# EAGLE design v1.0 (EAGLE 9.2.2)
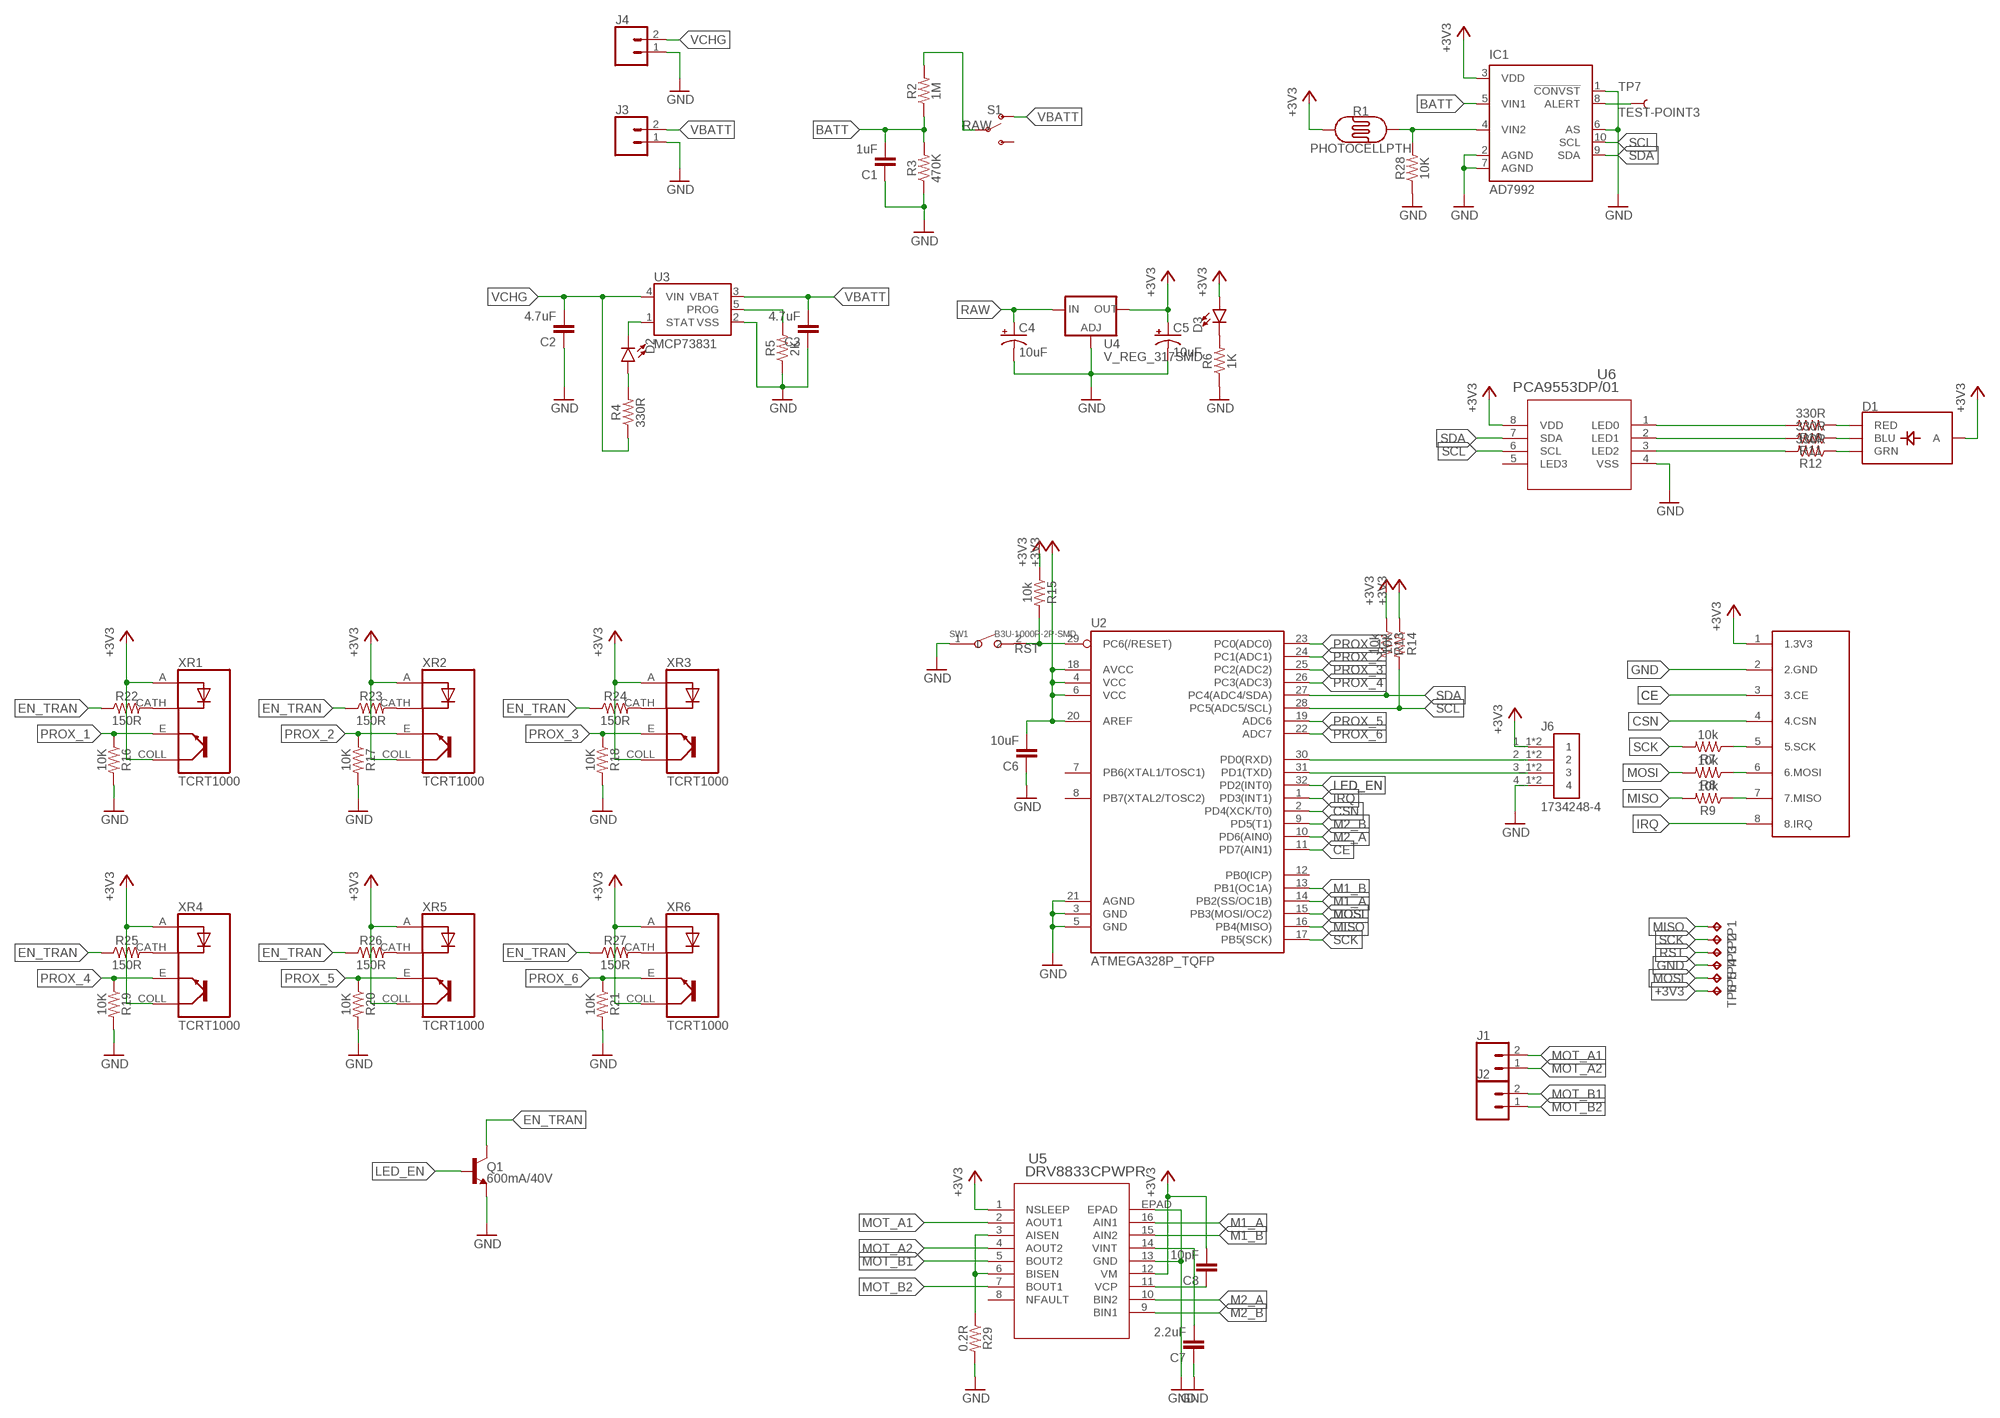
[diagram p0: schematic, sheet 1]

## Parts
C1  1uF  C-EUC0603  [C0603]
C2  4.7uF  C-EUC0603  [C0603]
C3  4.7uF  C-EUC0603  [C0603]
C4  10uF  10UF-POLAR-EIA3216-16V-10%(TANT)  [EIA3216]
C5  10uF  10UF-POLAR-EIA3216-16V-10%(TANT)  [EIA3216]
C6  10uF  C-EUC0603  [C0603]
C7  2.2uF  C-EUC0603  [C0603]
C8  10pF  C-EUC0603  [C0603]
D1  LED-RGB-CASMD  [LED-TRICOLOR-SMD]
D2  LED0603  [LED-0603]
D3  LED0603  [LED-0603]
IC1  AD7992  [MSOP10]
J1  CONN_02  [1X02]
J2  CONN_02  [1X02]
J3  CONN_02  [1X02]
J4  CONN_02  [1X02]
J6  1734248-4  [TE_1734248-4]
Q1  600mA/40V  TRANS_NPN-MMBT2222AL  [SOT23-3]
R1  PHOTOCELLPTH  [PHOTOCELL]
R2  1M  RESISTOR0402  [0402]
R3  470K  RESISTOR0402  [0402]
R4  330R  RESISTOR0402  [0402]
R5  2K  RESISTOR0402  [0402]
R6  1K  RESISTOR0402  [0402]
R7  10k  RESISTOR0402  [0402]
R8  10k  RESISTOR0402  [0402]
R9  10k  RESISTOR0402  [0402]
R10  330R  RESISTOR0402  [0402]
R11  330R  RESISTOR0402  [0402]
R12  330R  RESISTOR0402  [0402]
R13  10k  RESISTOR0402  [0402]
R14  10k  RESISTOR0402  [0402]
R15  10k  RESISTOR0402  [0402]
R16  10K  RESISTOR0402  [0402]
R17  10K  RESISTOR0402  [0402]
R18  10K  RESISTOR0402  [0402]
R19  10K  RESISTOR0402  [0402]
R20  10K  RESISTOR0402  [0402]
R21  10K  RESISTOR0402  [0402]
R22  150R  RESISTOR0402  [0402]
R23  150R  RESISTOR0402  [0402]
R24  150R  RESISTOR0402  [0402]
R25  150R  RESISTOR0402  [0402]
R26  150R  RESISTOR0402  [0402]
R27  150R  RESISTOR0402  [0402]
R28  10K  RESISTOR0402  [0402]
R29  0.2R  RESISTOR0402  [0402]
S1  SWITCH-SPDT-SMD-RIGHT-ANGLE  [SWITCH_SPST_SMD_A]
SW1  B3U-1000P-2P-SMD  SMD-BUTTON(2P-3.0X2.5X1.2+0.4MM)-B3U-1000P-2P-SMD  [SW2-2.6-3.0X2.5X1.2+0.4MM]
TP1  TPB1,27  [B1,27]
TP2  TPB1,27  [B1,27]
TP3  TPB1,27  [B1,27]
TP4  TPB1,27  [B1,27]
TP5  TPB1,27  [B1,27]
TP6  TPB1,27  [B1,27]
TP7  TEST-POINT3  [PAD.03X.03]
U2  ATMEGA328P_TQFP  [TQFP32-08]
U3  MCP73831  [SOT23-5]
U4  V_REG_317SMD  [SOT223]
U5  DRV8833CPWPR  [PWP16_2P31X2P46]
U6  PCA9553DP/01  [SOT505-1]
U$1  NRF24L01+  [NRF24L01+]
XR1  TCRT1000  [XDCR_TCRT1000]
XR2  TCRT1000  [XDCR_TCRT1000]
XR3  TCRT1000  [XDCR_TCRT1000]
XR4  TCRT1000  [XDCR_TCRT1000]
XR5  TCRT1000  [XDCR_TCRT1000]
XR6  TCRT1000  [XDCR_TCRT1000]

## Nets
+3V3: C5.+ C6.2 C8.2 D1.A D3.A IC1.3(VDD) J6.1_1 J6.1_2 R1.1 R13.1 R14.1 R15.1 TP6.TP U2.4(VCC) U2.6(VCC) U2.18(AVCC) U2.20(AREF) U4.2(OUT) U5.1(NSLEEP) U5.12(VM) U6.8(VDD) U$1.1(1.3V3) XR1.A XR1.COLL(CO) XR2.A XR2.COLL(CO) XR3.A XR3.COLL(CO) XR4.A XR4.COLL(CO) XR5.A XR5.COLL(CO) XR6.A XR6.COLL(CO)
BATT: C1.2 IC1.5(VIN1) R2.1 R3.2
CE: U2.11(PD7(AIN1)) U$1.3(3.CE)
CSN: U2.2(PD4(XCK/T0)) U$1.4(4.CSN)
EN_TRAN: Q1.3(C) R22.1 R23.1 R24.1 R25.1 R26.1 R27.1
GND: C1.1 C2.1 C3.1 C4.- C5.- C6.1 C7.1 IC1.1(!CONVST) IC1.2(AGND) IC1.6(AS) IC1.7(AGND) J3.1 J4.1 J6.4_1 J6.4_2 Q1.2(E) R3.1 R5.1 R6.1 R16.2 R17.2 R18.2 R19.2 R20.2 R21.2 R28.1 R29.2 SW1.1 TP4.TP U2.3(GND) U2.5(GND) U2.21(AGND) U3.2(VSS) U4.1(ADJ) U5.13(GND) U5.EPAD U6.4(VSS) U$1.2(2.GND)
IRQ: U2.1(PD3(INT1)) U$1.8(8.IRQ)
LED_EN: Q1.1(B) U2.32(PD2(INT0))
M1_A: U2.14(PB2(SS/OC1B)) U5.16(AIN1)
M1_B: U2.13(PB1(OC1A)) U5.15(AIN2)
M2_A: U2.10(PD6(AIN0)) U5.10(BIN2)
M2_B: U2.9(PD5(T1)) U5.9(BIN1)
MISO: R9.2 TP1.TP U2.16(PB4(MISO))
MOSI: R8.2 TP5.TP U2.15(PB3(MOSI/OC2))
MOT_A1: J1.2 U5.2(AOUT1)
MOT_A2: J1.1 U5.4(AOUT2)
MOT_B1: J2.2 U5.5(BOUT2)
MOT_B2: J2.1 U5.7(BOUT1)
N$1: R7.1 U$1.5(5.SCK)
N$2: R8.1 U$1.6(6.MOSI)
N$3: D3.C R6.2
N$4: D2.C U3.1(STAT)
N$5: D2.A R4.2
N$6: R9.1 U$1.7(7.MISO)
N$7: D1.R(RED) R10.1
N$8: D1.B(BLU) R11.1
N$9: R5.2 U3.5(PROG)
N$10: D1.G(GRN) R12.1
N$11: R29.1 U5.3(AISEN) U5.6(BISEN)
N$12: IC1.4(VIN2) R1.2 R28.2
N$13: IC1.8(ALERT) TP7.P$1
N$14: C7.2 U5.14(VINT)
N$15: C8.1 U5.11(VCP)
N$16: J6.3_1 J6.3_2 U2.31(PD1(TXD))
N$17: J6.2_1 J6.2_2 U2.30(PD0(RXD))
N$20: R22.2 XR1.CATH(C)
N$23: R23.2 XR2.CATH(C)
N$24: R24.2 XR3.CATH(C)
N$25: R25.2 XR4.CATH(C)
N$27: R26.2 XR5.CATH(C)
N$29: R27.2 XR6.CATH(C)
PROX_1: R16.1 U2.23(PC0(ADC0)) XR1.E
PROX_2: R17.1 U2.24(PC1(ADC1)) XR2.E
PROX_3: R18.1 U2.25(PC2(ADC2)) XR3.E
PROX_4: R19.1 U2.26(PC3(ADC3)) XR4.E
PROX_5: R20.1 U2.19(ADC6) XR5.E
PROX_6: R21.1 U2.22(ADC7) XR6.E
RAW: C4.+ R2.2 S1.2(P) U4.3(IN)
RGB-1: R10.2 U6.1(LED0)
RGB-2: R11.2 U6.2(LED1)
RGB-3: R12.2 U6.3(LED2)
RST: R15.2 SW1.2 TP3.TP U2.29(PC6(/RESET))
SCK: R7.2 TP2.TP U2.17(PB5(SCK))
SCL: IC1.10(SCL) R14.2 U2.28(PC5(ADC5/SCL)) U6.6(SCL)
SDA: IC1.9(SDA) R13.2 U2.27(PC4(ADC4/SDA)) U6.7(SDA)
VBATT: C3.2 J3.2 S1.1(O) U3.3(VBAT)
VCHG: C2.2 J4.2 R4.1 U3.4(VIN)
Unconnected: S1.3(S) U2.7(PB6(XTAL1/TOSC1)) U2.8(PB7(XTAL2/TOSC2)) U2.12(PB0(ICP)) U5.8(NFAULT) U6.5(LED3)

## Library data of the parts
C1-C3 C6-C8 = resistor:C-EU: CAPACITOR, European symbol
C4 C5 = SparkFun-Capacitors:10UF-POLAR: 10.0µF polarized capacitors A capacitor is a passive two-terminal electrical component used to store electrical energy temporarily in an electric field.; PROD_ID: CAP-00811
D1 = thesis:LED-RGB-CA: LED-RGB Diffused Common Anode Packages: LED RGB-THRU P-LCC-4-3 LED-TRICOLOR-SMD SparkFun Products: RGB Diffused Common Anode- Diffuse <[https://www.sparkfun.com/products/10821]> RGB Diffused Common Anode - Clear <[https://www.sparkfun.com/products/10820]> Qduino Mini <[https://www.sparkfun.com/products/13614]> Triple Output LED RGB - SMD <https://www.sparkfun.com/products/7844>; PROD_ID: DIO-08324
D2 D3 = SparkFun-LED:LED: LED (Generic) Standard schematic elements and footprints for 5mm, 3mm, 1206, and 0603 sized LEDs. Generic LEDs with no color specified.
IC1 = analog-devices:AD7992: 2-Channel, 12-Bit ADC with I2C-Compatible Interface 10-Lead MSOP Source: http://www.analog.com/UploadedFiles/Data_Sheets/224965274AD7992_0.pdf; MPN: AD7992BRMZ-0; OC_FARNELL: 1078311; OC_NEWARK: 31M4422
J1-J4 = SparkFun-Connectors:CONN_02: Multi connection point. Often used as Generic Header-pin footprint for 0.1 inch spaced/style header connections On any of the 0.1 inch spaced packages, you can populate with these: Break Away Headers - Straight <https://www.sparkfun.com/products/116> (PRT-00116) Break Away Male Headers - Right Angle <https://www.sparkfun.com/products/553> (PRT-00553) Female Headers <https://www.sparkfun.com/products/115> (PRT-00115) Break Away Headers - Machine Pin <https://www.sparkfun.com/products/117> (PRT-00117) Break Away Female Headers - Swiss Machine Pin <https://www.sparkfun.com/products/743> (PRT-00743) For SCREWTERMINALS and SPRING TERMINALS visit here: Screw Terimnals on SparkFun.com <https://www.sparkfun.com/search/results?term=Screw+Terminals> (5mm/3.5mm/2.54mm spacing) This device is also useful as a general connection point to wire up your design to another part of your project. Our various solder wires solder well into these plated through hole pads. Hook-Up Wire - Assortment (Stranded, 22 AWG) <https://www.sparkfun.com/products/11375> (PRT-11375) Hook-Up Wire - Assortment (Solid Core, 22 AWG) <https://www.sparkfun.com/products/11367> (PRT-11367) View the entire wire category on our website here <https://www.sparkfun.com/categories/141> Special notes: Molex polarized connector foot print use with: PRT-08233 with associated crimp pins and housings. 2.54_SCREWTERM for use with PRT-10571. 3.5mm Screw Terminal footprints for PRT-08084 5mm Screw Terminal footprints for use with PRT-08432
J6 = 1734248-4:1734248-4: CONN FPC VERT 4POS 1.00MM SMD; COMMENT: 1734248-4; DESCRIPTION: Te Connectivity 1734248-4 / Fpc Zip Connector 4 Pos.; DIGI-KEY_PART_NUMBER: A101414CT-ND; DIGI-KEY_PURCHASE_URL: https://www.digikey.in/product-detail/en/te-connectivity-amp-connectors/1734248-4/A101414CT-ND/2567550?utm_source=snapeda&utm_medium=aggregator&utm_campaign=symbol; EU_ROHS_COMPLIANCE: Compliant; MF: TE Connectivity; MP: 1734248-4; PACKAGE: None; TE_PURCHASE_URL: https://www.te.com/usa-en/product-1734248-4.html?te_bu=Cor&te_type=disp&te_campaign=seda_glo_cor-seda-global-disp-prtnr-fy19-seda-model-bom-cta_sma-317_1&elqCampaignId=32493
Q1 = SparkFun-DiscreteSemi:TRANS_NPN: NPN transistor Current controlled devices typically used to amplify current or used as a switch. BC547 - COM-08928 <http://www.sparkfun.com/products/8928> (TO-92 45V 100mA) (1.Collector 2.Base 3.Emitter) 2N3904 - COM-00521 <http://www.sparkfun.com/products/521> (TO-92 40V 200mA) (1.Emitter 2.Base 3.Collector) P2N2222A - COM-12852 <http://www.sparkfun.com/products/12852> (TO-92 40V 600mA) (1.Collector 2.Base 3.Emitter); PROD_ID: TRANS-08049
R1 = SparkFun-Sensors:PHOTOCELL: Photocell (Photodetector, Photo Resistor, CdS) This is a very small light sensor. A photocell changes (also called a photodetector, photo resistor, CdS or photoconductive cell) resistance depending on the amount of light it is exposed to. These little sensors make great ambient light triggers (when light in the room turns on, do something). Datasheet <http://cdn.sparkfun.com/datasheets/Sensors/LightImaging/SEN-09088.pdf> SparkFun Products Mini Photocell <https://www.sparkfun.com/products/9088> (SEN-09088); PROD_ID: COMP-09129; SF_ID: SEN-09088
R2-R29 = SparkFun-Resistors:RESISTOR: Generic Resistor Package
S1 = SparkFun-Switches:SWITCH-SPDT: Single Pole, Double Throw (SPDT) Switch Single-pole, double-throw (SPDT) switch. Variant Overview SMD-AYZ0202 Surface Mount DPDT Switch <https://www.sparkfun.com/products/597> (COM-00597) Used on e.g. LilyPad Arduino USB - ATmega32U4 Board <https://www.sparkfun.com/products/12049> PTH-11.6X4.0MM SPDT Mini Power Switch <https://www.sparkfun.com/products/102> (COM-00102) Used on e.g. SparkFun Simon Says - Through-Hole Soldering Kit <https://www.sparkfun.com/products/10547> (KIT-10547) PTH-11.6X4.0MM-KIT KIT version of SPDT Mini Power Switch - Simplifies soldering by removing tStop of switch pins - only one side can be soldered. PTH-11.6X4.0MM-LOCK LOCK version of SPDT Mini Power Switch - Offset pins hold switch in place for easier soldering. SMD-RIGHT-ANGLE Surface Mount Right Angle Switch <https://www.sparkfun.com/products/10860> (COM-10860) Used on e.g. SparkFun ESP8266 Thing <https://www.sparkfun.com/products/13231>; PROD_ID: SWCH-10651; SF_SKU: COM-10860
SW1 = Seeed-Switch:SMD-BUTTON(2P-3.0X2.5X1.2+0.4MM): 311020047; MPN: B3U-1000P-2P-SMD
TP1-TP6 = testpad:TP: Test pad
TP7 = SparkFun-Connectors:TEST-POINT: SparkFun Test Points Bare copper test points for troubleshooting or In-Circuit-Testing. These are used by our Production team for verifying production board runs using pogo-pins on test beds. SparkFun Products: SparkFun LSM9DS1 Breakout <https://www.sparkfun.com/products/13284> SparkFun PSOC <https://www.sparkfun.com/products/13714> SparkFun Load Cell Amplifier <https://www.sparkfun.com/products/13879>
U2 = thesis:ATMEGA328P_TQFP: Popular 328P in QFP Storefront component: ATmega328 - TQFP <https://www.sparkfun.com/products/13448> (COM-13448) Datasheet <http://www.sparkfun.com/datasheets/Components/SMD/ATMega328.pdf> SparkFun Products SparkFun RedBoard - Programmed with Arduino <https://www.sparkfun.com/products/12757> (DEV-12757) Arduino Pro Mini 328 - 5V/16MHz <https://www.sparkfun.com/products/11113> (DEV-11113) Arduino Pro Mini 328 - 3.3V/8MHz <https://www.sparkfun.com/products/11114> (DEV-11114) SparkFun OpenLog <https://www.sparkfun.com/products/13712> (DEV-13712) SparkFun MicroView - OLED Arduino Module <https://www.sparkfun.com/products/12923> (DEV-12923) SparkFun Digital Sandbox <https://www.sparkfun.com/products/12651> (DEV-12651) SparkFun PicoBoard <https://www.sparkfun.com/products/11888> (WIG-11888) Arduino Fio <https://www.sparkfun.com/products/10116> (DEV-10116) LilyPad Arduino 328 Main Board <https://www.sparkfun.com/products/13342> (DEV-13342) SparkFun RedStick <https://www.sparkfun.com/products/13741> (DEV-13741) LilyPad MP3 <https://www.sparkfun.com/products/11013> (DEV-11013) LilyPad Arduino SimpleSnap <https://www.sparkfun.com/products/10941> (DEV-10941) SparkFun Stepoko <https://www.sparkfun.com/products/13899> (ROB-13899) SparkFun Geiger Counter <https://www.sparkfun.com/products/11345> (SEN-11345) SparkFun EL Sequencer <https://www.sparkfun.com/products/12781> (COM-12781) Arduino Pro 328 - 5V/16MHz <https://www.sparkfun.com/products/10915> (DEV-10915) CryptoCape <https://www.sparkfun.com/products/12773> (DEV-12773) SparkFun IR Thermometer Evaluation Board - MLX90614 <https://www.sparkfun.com/products/10740> (SEN-10740) SparkFun RedBot Mainboard <https://www.sparkfun.com/products/12097> (ROB-12097) Arduino Pro 328 - 3.3V/8MHz <https://www.sparkfun.com/products/10914> (DEV-10914) SparkFun Block for Intel® Edison - Arduino <https://www.sparkfun.com/products/13036> (DEV-13036) SparkFun Simon Says - Surface Mount Soldering Kit <https://www.sparkfun.com/products/10935> (KIT-10935) SparkFun 7-Segment Serial Display - Red <https://www.sparkfun.com/products/11441> (COM-11441) SparkFun 7-Segment Serial Display - White <https://www.sparkfun.com/products/11629> (COM-11629) SparkFun 7-Segment Serial Display - Yellow <https://www.sparkfun.com/products/11443> (COM-11443) SparkFun 7-Segment Serial Display - Kelly Green <https://www.sparkfun.com/products/11440> (COM-11440) SparkFun 7-Segment Serial Display - Blue <https://www.sparkfun.com/products/11442> (COM-11442) SparkFun OpenSegment Serial Display - 20mm (Blue) <https://www.sparkfun.com/products/11647> (COM-11647) SparkFun OpenSegment Serial Display - 20mm (Green) <https://www.sparkfun.com/products/11646> (COM-11646) SparkFun OpenSegment Serial Display - 20mm (White) <https://www.sparkfun.com/products/11648> (COM-11648) SparkFun OpenSegment Serial Display - 20mm (Red) <https://www.sparkfun.com/products/11644> (COM-11644) SparkFun OpenSegment Serial Display - 20mm (Yellow) <https://www.sparkfun.com/products/11645> (COM-11645) SparkFun OpenSegment Shield <https://www.sparkfun.com/products/13190> (DEV-13190); PROD_ID: IC-09069
U3 = SparkFun-IC-Power:MCP73831: MCP73831T Li-Ion, Li-Pol Controller Miniature single cell, fully integrated Li-Ion, Li-polymer charge management controller Datasheet <http://ww1.microchip.com/downloads/en/DeviceDoc/20001984g.pdf> SparkFun Products: SparkFun ESP32 Thing <https://www.sparkfun.com/products/13907> SparkFun 9DoF Razor IMU M0 <https://www.sparkfun.com/products/14001>; PROD_ID: IC-09995
U4 = SparkFun-IC-Power:V_REG_317: Voltage Regulator Standard LM317 adjustable voltage regulator. AOI (Adjust Output Input). Google 'LM317 Calculator' for easy to use app to get the two resistor values needed. 240/720 for 5V output. 240/390 for 3.3V output. Spark Fun Electronics SKU : COM-00527
U5 = thesis:DRV8833CPWPR; MANUFACTURER_PART_NUMBER: DRV8833CPWPR; VENDOR: Texas Instruments
U6 = thesis:PCA9553DP/01; MANUFACTURER_PART_NUMBER: PCA9553DP01; VENDOR: NXP
U$1 = thesis:NRF24L01+
XR1-XR6 = thesis:TCRT1000: Optical Sensor The TCRT1000 and TCRT1010 are reflective sensors which include an infrared emitter and phototransistor in a leaded package which blocks visible light; AVAILABILITY: Unavailable; DESCRIPTION: 950 nm 50 mA Through Hole Reflective Optical Sensor with Transistor Output; MF: Vishay; MP: TCRT1000; PACKAGE: PCB Mount Vishay; PRICE: None

## Board
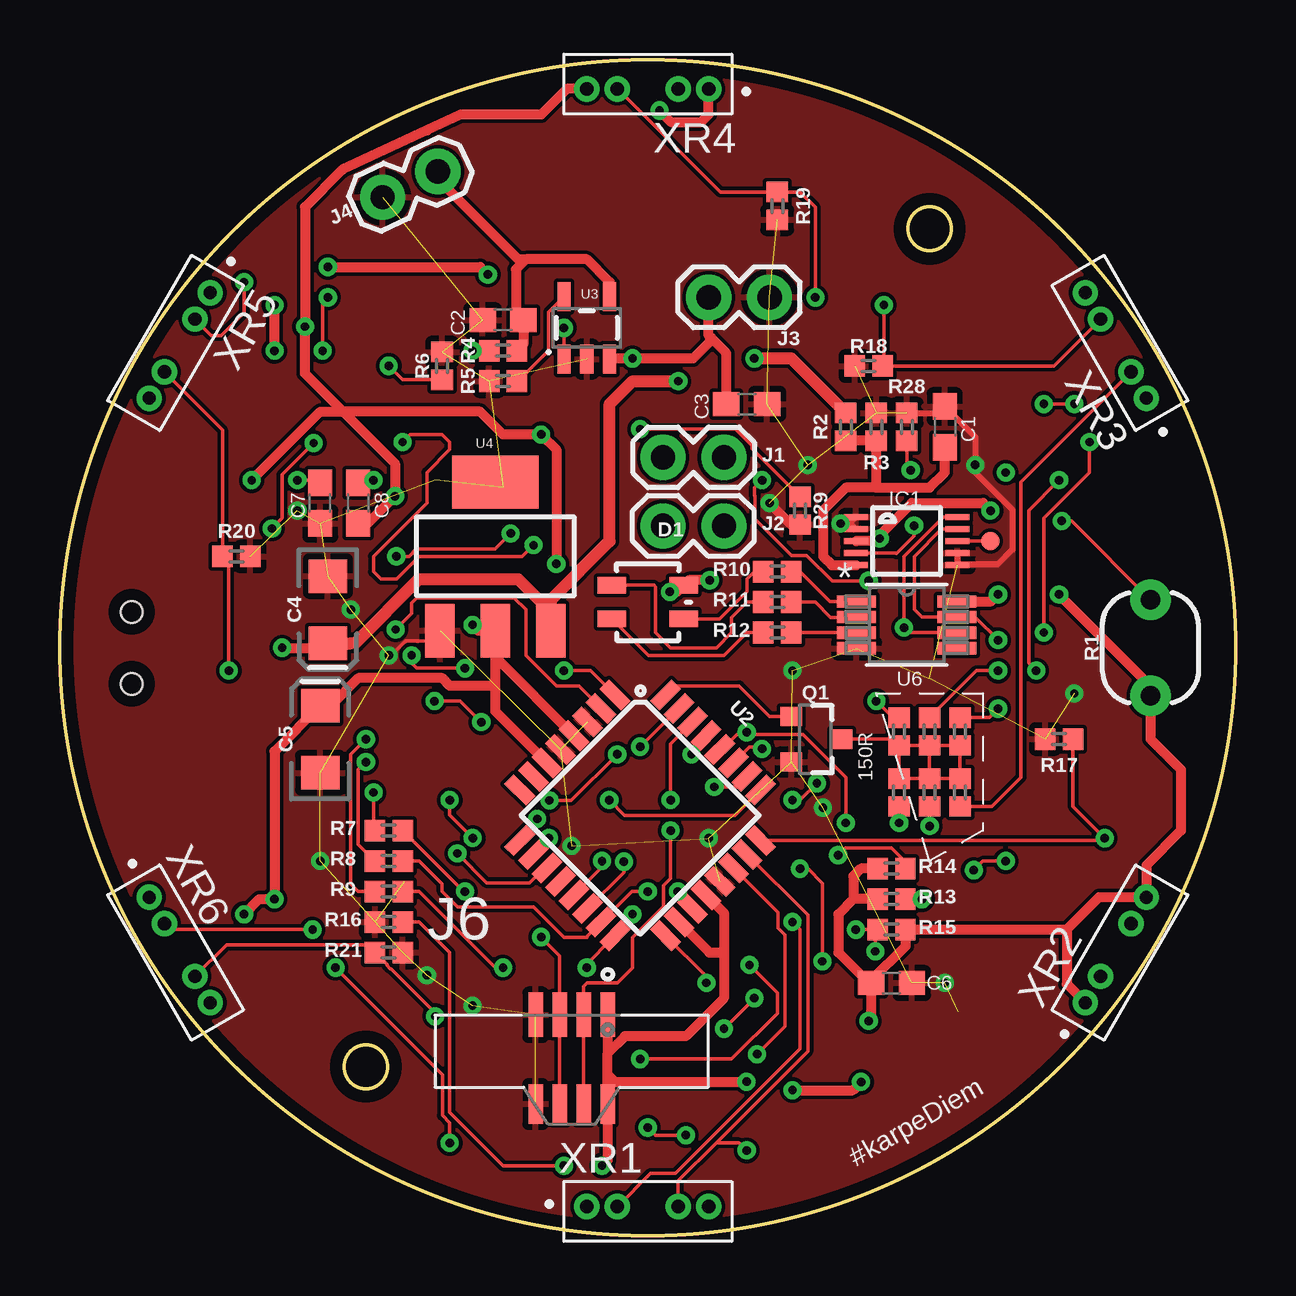
[diagram p1: board, top side]
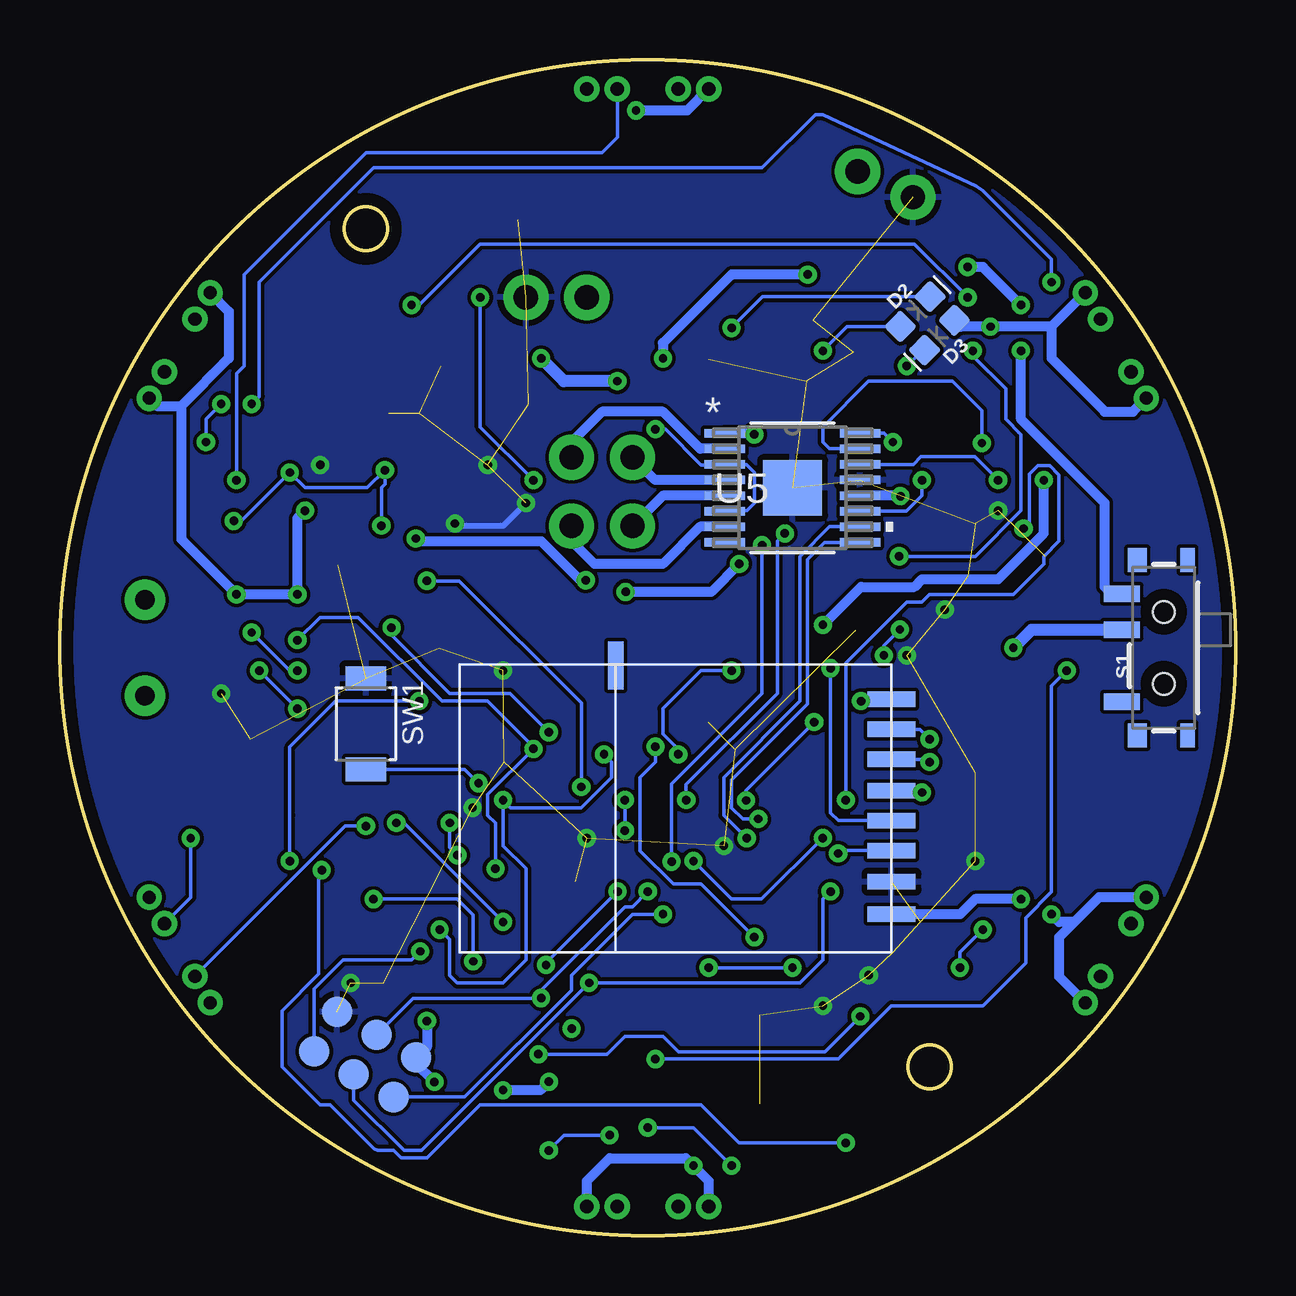
[diagram p2: board, bottom side, seen from below]

Size 49 x 49 mm. Coordinates in mm from the lower left corner, seen from the top.
Outline: circle at 24.5,24.5 radius 24.5
Outline: circle at 12.75,7.04 radius 0.9
Outline: circle at 36.25,41.96 radius 0.9
Copper layers (1*16): Top 0.035mm / dielectric 1.5mm / Bottom 0.035mm
Design rules "default *": minimum track width 6mil, minimum drill 0.35mm, track to track 6mil, track to pad 6mil, pad to pad 6mil, via to via 6mil, smd to smd 6mil, copper to edge 20mil, drill to drill 6mil, minimum pad ring 10mil, minimum via ring 8mil, stop-mask expansion 4mil, vias tented up to drill 0mil, thermal gap 10mil

### Footprints (pad centres in the part's own frame; a part is rotated, then mirrored left to right if it is on the bottom)
C0603 = smd 1.1 x 1: 1 -0.85,0; 2 0.85,0
EIA3216 = smd 1.4 x 1.6: + 1.4,0; - -1.4,0
LED-TRICOLOR-SMD = smd 1.2 x 0.7: A 1.5,0.7; B -1.5,0.7; G -1.5,-0.7; R 1.5,-0.7
LED-0603 = smd 1 x 1: A -0.877,0; C 0.877,0
MSOP10 = smd 0.25 x 1: 1 -1,-2.113; 2 -0.5,-2.113; 3 0,-2.113; 4 0.5,-2.113; 5 1,-2.113; 6 1,2.113; 7 0.5,2.113; 8 0,2.113; 9 -0.5,2.113; 10 -1,2.113
1X02 = drill 1.016 pad 1.88: 1 0,0; 2 2.54,0
TE_1734248-4 = smd 0.6 x 1.85: 1_1 1.5,1.85; 2_1 0.5,1.85; 3_1 -0.5,1.85; 4_1 -1.5,1.85 | smd 0.6 x 1.65: 1_2 1.5,-1.875; 2_2 0.5,-1.875; 3_2 -0.5,-1.875; 4_2 -1.5,-1.875
SOT23-3 = smd 0.8 x 0.9: 1 -0.95,-1; 2 0.95,-1; 3 0,1.1
PHOTOCELL = drill 0.8 pad 1.676: 1 -2,0; 2 2,0
0402 = smd 0.85 x 0.9: 1 -0.58,0; 2 0.58,0
SWITCH_SPST_SMD_A = smd 0.7 x 1.5: 1 -2.25,-1.75; 2 -0.75,-1.75; 3 2.25,-1.75 | smd 1 x 0.6: GND1 -3.65,1; GND3 3.65,1 | smd 1 x 0.8: GND2 -3.65,-1.1; GND4 3.65,-1.1 | hole 0.9: -1.5,0; 1.5,0
SW2-2.6-3.0X2.5X1.2+0.4MM = smd 1 x 1.7: 1 -1.9,0; 2 1.9,0
B1,27 = smd 1.27 x 1.27: TP 0,0
PAD.03X.03 = smd 0.762 x 0.762: P$1 0,0
TQFP32-08 = smd 1.27 x 0.559: 1 -4.293,2.8; 2 -4.293,2; 3 -4.293,1.2; 4 -4.293,0.4; 5 -4.293,-0.4; 6 -4.293,-1.2; 7 -4.293,-2; 8 -4.293,-2.8; 17 4.293,-2.8; 18 4.293,-2; 19 4.293,-1.2; 20 4.293,-0.4; 21 4.293,0.4; 22 4.293,1.2; 23 4.293,2; 24 4.293,2.8 | smd 0.559 x 1.27: 9 -2.8,-4.293; 10 -2,-4.293; 11 -1.2,-4.293; 12 -0.4,-4.293; 13 0.4,-4.293; 14 1.2,-4.293; 15 2,-4.293; 16 2.8,-4.293; 25 2.8,4.293; 26 2,4.293; 27 1.2,4.293; 28 0.4,4.293; 29 -0.4,4.293; 30 -1.2,4.293; 31 -2,4.293; 32 -2.8,4.293
SOT23-5 = smd 0.55 x 1.2: 1 -0.95,-1.3; 2 0,-1.3; 3 0.95,-1.3; 4 0.95,1.3; 5 -0.95,1.3
SOT223 = smd 1.219 x 2.235: 1 -2.311,-3.099; 2 0,-3.099; 3 2.311,-3.099 | smd 3.6 x 2.2: 4 0,3.099
PWP16_2P31X2P46 = smd 1.676 x 0.356: 1 -2.819,2.275; 2 -2.819,1.625; 3 -2.819,0.975; 4 -2.819,0.325; 5 -2.819,-0.325; 6 -2.819,-0.975; 7 -2.819,-1.625; 8 -2.819,-2.275; 9 2.819,-2.275; 10 2.819,-1.625; 11 2.819,-0.975; 12 2.819,-0.325; 13 2.819,0.325; 14 2.819,0.975; 15 2.819,1.625; 16 2.819,2.275 | smd 2.46 x 2.31: EPAD 0,0
SOT505-1 = smd 1.626 x 0.508: 1 -2.095,0.975; 2 -2.095,0.325; 3 -2.095,-0.325; 4 -2.095,-0.975; 5 2.095,-0.975; 6 2.095,-0.325; 7 2.095,0.325; 8 2.095,0.975
NRF24L01+ = smd 0.65 x 2: 1 1.6,0; 2 2.95,0; 3 4.25,0; 4 5.5,0; 5 6.75,0; 6 8.05,0; 7 9.3,0; 8 10.55,0 | smd 2 x 0.65: 9 11.96,11.49
XDCR_TCRT1000 = drill 0.55 pad 1.016: A -2.54,0.2; CATH -1.27,0.2; COLL 2.54,0.2; E 1.27,0.2

### Placement (x,y rotation side)
C1  36.88,33.71 270 top
C2  18.47,38.15 0 top
C3  28.63,34.66 180 top
C4  11.17,26.09 270 top
C5  10.85,20.69 90 top
C6  34.66,10.53 180 top
C7  10.85,30.53 90 top
C8  12.44,30.53 270 top
D1  24.5,26.41 0 top
D2  13.35,38.51 45 bottom
D3  12.34,37.53 225 bottom
IC1  35.3,28.95 270 top
J1  25.14,32.44 0 top
J2  27.68,29.58 180 top
J3  29.58,39.11 180 top
J4  13.45,43.28 25 top
J6  21.32,7.36 0 top
Q1  31.48,20.69 270 top
R1  45.45,24.5 90 top
R2  32.75,33.71 90 top
R3  34.03,33.71 270 top
R4  18.47,36.88 180 top
R5  18.47,35.61 0 top
R6  15.93,36.25 270 top
R7  13.71,16.88 0 top
R8  13.71,15.61 0 top
R9  13.71,14.34 0 top
R10  29.9,27.68 0 top
R11  29.9,26.41 0 top
R12  29.9,25.14 0 top
R13  34.66,14.02 0 top
R14  34.66,15.29 0 top
R15  34.66,12.75 180 top
R16  13.71,13.07 180 top
R17  41.64,20.69 180 top
R18  33.71,36.25 180 top
R19  29.9,42.91 270 top
R20  7.36,28.31 0 top
R21  13.71,11.8 0 top
R22  34.98,18.47 270 top
R23  36.25,18.47 270 top
R24  37.52,18.47 270 top
R25  37.52,21.01 90 top
R26  36.25,21.01 90 top
R27  34.98,21.01 90 top
R28  35.3,33.71 270 top
R29  30.85,30.21 270 top
S1  3,24.5 270 bottom
SW1  36.25,21.33 270 bottom
TP1  35.1,5.77 60 bottom
TP2  36.75,6.72 60 bottom
TP3  38.4,7.68 60 bottom
TP4  37.45,9.33 60 bottom
TP5  35.8,8.37 60 bottom
TP6  34.15,7.42 60 bottom
TP7  38.79,28.95 0 top
U2  24.18,17.52 315 top
U3  21.96,37.84 0 top
U4  18.15,28.31 0 top
U5  18.47,31.17 0 bottom
U6  35.3,25.45 0 top
U$1  14.34,11.8 90 bottom
XR1  24.5,1.01 0 top
XR2  44.19,11.8 60 top
XR3  44.19,37.2 120 top
XR4  24.5,48 180 top
XR5  4.82,37.2 240 top
XR6  4.82,11.8 300 top

### Tracks (layer width: path | path; a pad name or v marks a point on that pad's centre or on a via)
+3V3  (via drill 0.35)
  Top 0.406: XR2.A 41.96,10.48 41.96,12.75 | 41.96,12.75 43.31,14.1 XR2.COLL 45.28,15.44 46.72,16.88 46.72,19.42 45.45,20.69 R1.1 45.45,22.91 v41.64,26.72 | 33.81,10.63 C6.2 33.81,9.05 v33.71,8.94 | 33.81,10.63 35.24,12.06 R15.1 41.96,12.75 | R13.1 33.07,14.02 | 33.07,14.02 32.44,13.39 32.44,11.8 33.61,10.63 33.81,10.63 | R14.1 33.39,15.29 33.07,14.98 33.07,14.02 | U2.20 27.68,13.46 27.68,11.8 | 27.68,11.8 27.68,9.9 26.09,8.31 23.55,8.31 22.82,7.59 | C8.2 12.83,29.68 v13.96,30.82 13.96,32.18 11.8,34.34 | U4.2 18.15,24.11 U2.4 | U2.6 18.15,21.85 18.15,22.91 | 18.15,22.91 U4.2 | 11.8,34.34 10.21,35.93 v10.21,37.88 10.21,42.87 11.76,44.42 15.3,46.07 16.71,46.73 20.05,46.73 21.12,47.8 XR4.COLL | v7.67,13.39 8.31,14.02 v8.94,14.02 8.94,20.19 C5.+ 11.3,22.09 12.44,23.23 15.93,23.23 16.25,22.91 18.15,22.91 | v27.08,27.32 26.21,27.32 D1.A 25.73,26.83 v25.42,26.83 | U6.8 38.81,26.43 v39.11,26.72 | 11.8,34.34 17.52,34.34 18.47,33.39 v20.05,33.39 20.69,32.76 v20.69,27.99 | v38.79,30.21 38.47,30.53 35.51,30.53 33.94,28.96 | U2.18 27.07,11.8 27.68,11.8 | U4.2 17.44,25.21 v17.2,25.45 | 11.8,34.34 10.85,34.34 v7.99,31.48 | IC1.3 33.2,28.96 33.94,28.96 | 33.94,28.96 34.08,28.96 v34.16,29.05 | v30.53,6.06 33.04,6.06 v33.39,6.4 | J6.1_1 22.82,7.59 | v22.6,2.91 22.82,3.14 J6.1_2 22.82,6.72 | 22.82,6.72 22.82,7.59 | v24.99,46.9 25.48,46.41 26.72,46.41 27.04,46.73 XR4.A | v28.62,6.41 28.61,6.4 23.14,6.4 22.82,6.72
  Bottom 0.406: XR1.COLL 27.04,2.28 26.09,3.23 22.91,3.23 v22.6,2.91 21.96,2.28 XR1.A | XR6.A 5.69,14.1 6.72,13.07 | XR6.COLL 7.36,10.8 7.36,12.44 6.72,13.07 | XR5.A 7.67,37.88 | 7.67,37.88 7.67,36.57 5.45,34.34 4.28,34.34 XR5.COLL | XR3.COLL 41.96,38.52 41.96,36.57 43.95,34.58 | XR3.A 44.96,34.58 43.95,34.58 | v13.96,30.82 13.99,30.84 U5.12 | 7.67,37.88 v10.21,37.88 11.46,37.88 D3.A | v33.71,8.94 33.71,7.86 TP6.TP 34.15,7.16 v33.39,6.4 | 6.72,13.07 7.36,13.07 v7.67,13.39 | v8.94,14.02 10.85,14.02 11.48,13.39 14.33,13.39 U$1.1 | v27.08,27.32 27.32,27.32 28.95,28.95 34.06,28.95 v34.16,29.05 | 43.95,34.58 43.95,29.02 v41.64,26.72 v39.11,26.72 39.11,29.9 v38.79,30.21 | U5.1 20.11,33.44 v20.05,33.39 | v20.69,27.99 21.85,26.83 v25.42,26.83 | v17.2,25.45 15.61,27.04 13.39,27.04 13.07,27.36 9.9,27.36 7.99,29.26 v7.99,31.48 | v28.62,6.41 28.97,6.06 v30.53,6.06 | XR4.COLL 22.86,46.9 v24.99,46.9
BATT
  Top 0.406: R2.1 R3.2 34.03,31.17 | C1.2 36.88,31.8 36.25,31.17 34.03,31.17 | 34.03,31.17 32.75,31.17 31.8,30.21 31.8,28.31 32.17,27.95 IC1.5
CE  (via drill 0.35)
  Top 0.152: U2.11 20.2,15.33 19.58,14.7 17.79,14.7 v16.56,15.93
  Bottom 0.152: v16.56,15.93 16.44,16.05 U$1.3
CSN  (via drill 0.35)
  Top 0.152: U2.2 22.56,21.99 21.64,22.91 20.69,22.91 19.42,24.18 19.42,26.09 18.94,26.57 15.29,26.57 15.14,26.57 14.87,26.57 14.66,26.36 14.66,25.93 v13.99,25.26 | v16.88,23.65 16.12,23.65 16.11,23.66 14.86,23.66 14.66,23.87 v14.66,24.18
  Bottom 0.152: U$1.4 16.56,17.3 16.88,17.62 v16.88,23.65 | v14.66,24.18 14.66,24.59 v13.99,25.26
EN_TRAN
  Top 0.152: Q1.3 34.72,20.69 R27.1 | R27.1 R22.1 35.61,19.05 R23.1 | R23.1 R26.1 | R26.1 R27.1 | R26.1 R25.1 R24.1 R23.1
GND  (via drill 0.35)  (44 unrouted)
  Top 0.152: U4.1 15.42,24.79 14.41,24.79 13.8,24.18 v13.71,24.18 | 39.7,28.63 39.7,28.59
  Top 0.254: IC1.1 32.92,29.68 v32.54,29.68 32.95,29.68 IC1.2 | IC1.7 IC1.6 37.46,27.99 39.11,27.99 39.7,28.59 | 39.7,28.63 39.7,30.25 38.15,31.8 v38.15,32.12 38.15,33.29 C1.1 36.61,34.29 R28.1
  Top 0.406: R29.2 30.48,29.64 v29.58,30.53
  Bottom 0.254: v29.58,30.53 30.53,29.58 32.44,29.58 v32.54,29.68
  other vias: 10.85,15.61 42.28,22.6 15.29,10.85 21.32,16.25 30.53,23.55 31.17,32.12 31.8,17.83 17.2,9.58 36.88,10.53 12.12,26.09 9.9,30.21 27.04,16.56
  pour Top: -0.9,0.37 49.9,0.37 49.9,49.9 -0.9,49.9 -0.9,38.47
  pour Bottom: -0.9,49.9 49.9,49.9 49.9,-0.9 -0.9,-0.9
IRQ  (via drill 0.35)
  Top 0.152: U2.1 22.11,23.55 v21.01,23.55 | v23.23,20.05 21.31,18.14 v20.4,18.14 | v17.56,21.4 16.69,22.28 v15.61,22.28
  Bottom 0.152: v21.01,23.55 22.28,23.55 23.87,21.96 23.87,20.91 23.23,20.28 v23.23,20.05 | v20.4,18.14 20.4,18.56 v17.56,21.4 | v15.61,22.28 14.41,22.28 U$1.8
LED_EN
  Top 0.152: Q1.1 29.58,21.64 28.31,22.91 25.62,22.91 U2.32
M1_A  (via drill 0.35)
  Top 0.152: v14.28,33.07 14.6,33.39 15.93,33.39 16.25,33.07 16.25,32.76 15.29,31.8 15.29,30.53 13.07,28.31 13.07,27.68 13.39,27.36 14.02,27.36 14.98,28.31 19.27,28.31 v19.74,28.78 | v23.5,15.59 23.5,15.14 U2.14
  Bottom 0.152: U5.16 14.65,33.44 v14.28,33.07 | v19.74,28.78 19.74,22.6 23.5,18.83 v23.5,15.59
M1_B  (via drill 0.35)
  Top 0.152: v22.6,15.61 22.6,15.36 U2.13 | v17.21,16.57 16.25,17.53 v16.25,18.15 | v8.83,29.47 9.26,29.9 9.26,31.72 v10.57,33.03
  Bottom 0.152: v22.6,15.61 21.01,14.02 19.75,14.02 v17.21,16.57 | v16.25,18.15 16.25,23.87 13.71,26.41 13.07,26.41 12.75,26.72 9.26,26.72 7.99,27.99 7.99,28.31 7.36,28.95 7.36,31.71 7.74,32.09 8.24,32.09 8.6,31.74 8.6,29.7 v8.83,29.47 | v10.57,33.03 10.57,34.39 11.8,35.61 15.29,35.61 17.2,33.71 17.2,33.07 16.92,32.79 U5.15
M2_A  (via drill 0.35)
  Top 0.152: v20.37,16.56 19.73,15.92 U2.10
  Bottom 0.152: U5.10 16.92,29.54 18.15,28.31 18.15,25.14 18.15,22.28 21.32,19.1 21.32,17.52 v20.37,16.56
M2_B  (via drill 0.35)
  Top 0.152: v19.89,17.36 19.89,17.18 U2.9
  Bottom 0.152: U5.9 17.14,28.89 17.85,28.18 17.85,22.15 21.01,18.99 21.01,17.83 20.54,17.36 v19.89,17.36
MISO  (via drill 0.35)
  Top 0.152: R9.2 14.98,14.34 18.15,11.17 v18.47,11.17 | v21.96,11.17 21.96,11.33 22.99,12.36 | 22.99,12.36 U2.16 | v23.87,13.39 22.99,12.51 22.99,12.36
  Bottom 0.152: v18.47,11.17 v21.96,11.17 | TP1.TP 32.13,5.77 27.68,10.23 27.68,10.85 25.14,13.39 v23.87,13.39
MOSI  (via drill 0.35)
  Top 0.152: R8.2 14.98,15.61 15.93,14.66 15.93,14.34 16.56,13.71 19.74,13.71 21.01,12.44 21.96,12.44 21.96,12.46 U2.15 23.84,14.34 v24.5,14.34 | v28.95,9.9 v27.68,8.63
  Bottom 0.152: TP5.TP 34.28,9.9 v28.95,9.9 28.95,10.21 25.45,13.71 25.14,13.71 v24.5,14.34
MOT_A1
  Bottom 0.406: U5.2 22.32,32.79 23.87,34.34 26.41,34.34 27.68,33.07 J1.2
MOT_A2
  Bottom 0.406: U5.4 24.19,31.49 J1.1
MOT_B1
  Bottom 0.406: U5.5 23.87,30.84 J2.2
MOT_B2
  Bottom 0.406: U5.7 22.32,29.54 23.87,27.99 26.72,27.99 27.68,28.95 J2.1
N$1  (via drill 0.35)
  Top 0.152: R7.1 13.07,16.94 v13.07,18.47
  Bottom 0.152: v13.07,18.47 14.26,18.47 U$1.5
N$2  (via drill 0.35)
  Top 0.152: R8.1 12.44,16.3 12.44,19.42 v12.75,19.74
  Bottom 0.152: v12.75,19.74 12.87,19.85 U$1.6
N$3  (via drill 0.35)
  Top 0.152: R6.2 14.29,35.67 v13.71,36.25
  Bottom 0.152: v13.71,36.25 13.04,36.91 D3.C
N$4  (via drill 0.35)
  Top 0.152: U3.1 v21.01,37.83 v21.01,37.84
  Bottom 0.152: v21.01,37.84 19.71,39.13 D2.C
N$5  (via drill 0.35)
  Top 0.152: v17.2,36.88 R4.2
  Bottom 0.152: D2.A 16.19,37.89 v17.2,36.88
N$6  (via drill 0.35)
  Top 0.152: v12.75,20.69 12.12,20.05 12.12,14.66 12.44,14.34 R9.1
  Bottom 0.152: U$1.7 13.16,21.1 v12.75,20.69
N$7
  Top 0.152: D1.R 27.5,25.71 28.63,26.84 28.63,27.36 28.95,27.68 R10.1
N$8
  Top 0.152: D1.B 24.75,27.11 24.82,27.04 24.82,25.14 25.45,24.5 27.36,24.5 27.99,25.14 27.99,25.77 28.63,26.41 R11.1
N$9
  Top 0.152: U3.5 20.37,38.5 20.37,36.88 19.1,35.61 R5.2
N$10
  Top 0.152: D1.G 24.52,24.18 27.68,24.18 28.63,25.14 R12.1
N$11  (via drill 0.35)
  Top 0.152: R29.1 28.84,32.8 28.84,32.92 28.16,33.61 v24.18,33.61
  Bottom 0.152: v24.18,33.61 23.77,33.61 22.28,32.12 21.31,32.12 U5.3 20.39,32.14 20.05,31.8 20.05,30.53 20.37,30.21 21.26,30.21 U5.6
N$12  (via drill 0.35)
  Top 0.152: v41.76,29.79 42.17,29.79 R1.2 | R28.2 35.3,32.06 v35.46,31.9 | v35.6,29.59 35.6,29.16 34.86,28.42 34.84,28.45 IC1.4
  Bottom 0.152: v41.76,29.79 41.44,29.79 v39.42,31.8 38.79,31.17 36.19,31.17 v35.46,31.9 35.46,31.32 35.6,31.18 v35.6,29.59
N$13
  Top 0.152: IC1.8 TP7.P$1
N$14  (via drill 0.35)
  Top 0.152: C7.2 10.75,31.48 v9.9,31.48
  Bottom 0.152: v9.9,31.48 10.87,32.46 13.11,32.46 13.43,32.14 U5.14
N$15  (via drill 0.35)
  Top 0.152: v13.07,31.48 12.54,31.48 C8.1
  Bottom 0.152: U5.11 13.73,30.19 13.07,30.85 v13.07,31.48
N$16  (via drill 0.35)
  Top 0.152: J6.3_2 J6.3_1 20.82,11.67 v20.05,12.44 | v24.18,20.37 25.78,21.96 U2.31
  Bottom 0.152: v20.05,12.44 22.28,14.66 23.43,14.66 24.82,16.04 24.82,19.1 24.18,19.74 v24.18,20.37
N$17  (via drill 0.35)
  Top 0.152: U2.30 25.45,20.48 v25.45,18.15 | v25.45,16.88 25.45,14.89 25.15,14.59 25.15,13.72 23.87,12.44 23.87,11.17 23.23,10.53 21.96,10.53 21.82,10.4 J6.2_1 J6.2_2
  Bottom 0.152: v25.45,18.15 v25.45,16.88
N$20  (via drill 0.35)
  Top 0.152: XR1.CATH 24.62,2.59 25.66,2.59 30.85,7.79 30.85,12.75 v30.53,13.07 | v34.98,17.2 R22.2
  Bottom 0.152: v30.53,13.07 34.66,17.2 v34.98,17.2
N$23  (via drill 0.35)
  Top 0.152: v36.25,17.07 R23.2
  Bottom 0.152: XR2.CATH 37.11,17.07 v36.25,17.07
N$24
  Top 0.152: XR3.CATH 40.06,31.41 40.06,19.1 38.84,17.89 R24.2
N$25  (via drill 0.35)
  Top 0.152: R25.2 38.73,21.59 v39.11,21.96 | v40.69,23.55 40.38,23.87 40.38,30.21 v41.64,31.48
  Bottom 0.152: v39.11,21.96 v40.69,23.55 | v41.64,31.48 41.64,35.93 41.33,36.25 41.33,40.06 36.25,45.14 26.41,45.14 25.77,45.77 XR4.CATH
N$27  (via drill 0.35)
  Top 0.152: R26.2 38.21,23.55 v39.11,23.55 | v41.01,25.14 41.01,29.9 42.92,31.8 v42.92,33.07 | v42.28,34.66 v41.01,34.66 | v7.67,39.74 7.67,38.47 6.72,37.52 6.31,37.52 XR5.CATH
  Bottom 0.152: v39.11,23.55 39.42,23.55 v41.01,25.14 | v42.92,33.07 42.92,34.02 v42.28,34.66 | v41.01,34.66 40.69,34.98 40.69,39.74 35.93,44.5 19.74,44.5 17.52,46.73 17.2,46.73 10.81,43.75 10.53,43.55 7.67,40.69 v7.67,39.74
N$29  (via drill 0.35)
  Top 0.152: XR6.CATH 4.6,12.75 v10.53,12.75 | v11.48,11.17 15.94,6.71 15.94,5.01 16.25,4.7 v16.25,3.86 | v38.09,15.23 38.47,15.61 v39.42,15.61 | v34.03,22.28 34.72,21.59 R27.2
  Bottom 0.152: v10.53,12.75 11.48,11.8 v11.48,11.17 | v16.25,3.86 20.69,3.86 22.28,5.45 31.48,5.45 33.7,3.24 34.79,3.24 35.09,3.55 35.76,3.55 35.9,3.61 37.74,5.45 38.15,5.45 39.74,7.04 39.74,9.37 38.21,10.9 38.21,15.11 v38.09,15.23 | v39.42,15.61 39.42,17.51 39.42,17.52 39.42,20.37 37.52,22.28 v34.03,22.28
PROX_1  (via drill 0.35)
  Top 0.152: U2.23 31.17,13.36 31.17,7.67 27.36,3.86 | XR1.E 25.77,2.28 27.36,3.86 | R16.1 14.98,13.07 16.25,11.8 16.25,5.13 18.47,2.91 v21.01,2.91 | v24.5,4.5 24.82,4.18 v26.09,4.18 | v28.63,3.55 28.31,3.86 27.36,3.86
  Bottom 0.152: v21.01,2.91 22.6,4.5 v24.5,4.5 | v26.09,4.18 27.99,4.18 v28.63,3.55
PROX_2  (via drill 0.35)
  Top 0.152: R17.1 42.22,17.89 v43.55,16.56 43.45,16.46 U2.24
  Bottom 0.152: v43.55,16.56 43.55,14.1 XR2.E
PROX_3  (via drill 0.35)
  Top 0.152: XR3.E 41.42,36.25 34.34,36.25 | 34.34,36.25 R18.1 | U2.25 28.14,17.52 23.53,17.52 v22.9,18.15 | v18.79,29.26 18.14,28.62 14.85,28.62 14.54,28.31 v14.02,28.31 | v10.95,36.88 10.95,38.89 v11.17,39.11 | v34.34,38.79 34.34,36.25
  Bottom 0.152: v22.9,18.15 22.9,18.8 19.1,22.6 19.1,28.95 v18.79,29.26 | v14.02,28.31 10.85,28.31 8.94,30.21 8.94,33.39 9.58,34.02 9.58,35.3 10.95,36.66 v10.95,36.88 | v11.17,39.11 13.39,41.33 31.48,41.33 34.03,38.79 v34.34,38.79
PROX_4  (via drill 0.35)
  Top 0.152: XR4.E 27.53,43.5 R19.1 30.85,43.5 31.48,42.86 v31.48,39.11 | U2.26 28.19,18.7 v27.27,18.7 | v33.71,27.29 32.19,27.29 31.12,28.35 30.49,28.35 28.97,29.87 28.97,30.82 28.95,30.85 28.95,31.17 v29.26,31.48
  Bottom 0.152: v27.27,18.7 27.27,22.19 32.37,27.29 v33.71,27.29 | v29.26,31.48 31.48,33.71 v31.48,39.11
PROX_5  (via drill 0.35)
  Top 0.152: XR5.E 6.78,33.58 R20.1 7.04,28.05 v7.04,23.55 | U2.19 25.76,14.24 v25.76,14.34 | v28.74,11.28 29.9,10.12 29.9,9.26 27.99,7.36 v24.18,7.36
  Bottom 0.152: v25.76,14.34 28.74,11.36 v28.74,11.28 | v24.18,7.36 16.56,7.36 14.34,9.58 10.53,9.58 8.74,11.37 8.74,13.25 7.67,14.32 7.67,22.91 v7.04,23.55
PROX_6  (via drill 0.35)
  Top 0.152: XR6.E 6.94,12.12 12.81,12.12 R21.1 13.63,11.29 13.63,11.26 13.77,11.12 13.8,11.12 15.64,9.29 v15.64,9.14 | v29.05,7.56 30.21,8.72 30.21,12.53 29.93,12.82 29.93,13.47 U2.22
  Bottom 0.152: v15.64,9.14 17.12,7.66 23.22,7.66 23.87,8.31 25.45,8.31 26.2,7.56 v29.05,7.56
RAW  (via drill 0.35)
  Top 0.406: U4.3 20.46,26.09 | 20.46,26.09 20.46,26.49 | C4.+ 10.98,24.5 v9.26,24.5 | 12.12,24.69 12.31,24.69 | 20.42,26.13 20.46,26.09
  Top 0.508: C4.+ 12.12,24.69 | 12.31,24.69 14.98,27.36 19.1,27.36 20.33,26.13 20.42,26.13 | U4.3 20.46,26.49 22.91,28.95 22.91,34.66 23.87,35.61 v25.77,35.61 | v28.95,36.57 30.48,36.57 R2.2
  Bottom 0.508: S1.2 8.51,25.25 v9.26,24.5 | v25.77,35.61 27.99,35.61 v28.95,36.57
RGB-1
  Top 0.152: U6.1 32.1,26.43 30.85,27.68 R10.2
RGB-2
  Top 0.152: R11.2 31.48,26.41 32.12,25.77 U6.2
RGB-3
  Top 0.152: R12.2 U6.3
RST  (via drill 0.35)
  Top 0.152: v33.98,11.84 33.98,12.66 R15.2 v33.17,12.75 | v31.55,18.85 30.85,18.15 v30.53,18.15 | v26.32,20.05 26.94,20.67 U2.29
  Bottom 0.152: TP3.TP 38.4,10.28 37.2,11.48 34.34,11.48 v33.98,11.84 | SW1.2 32.12,19.43 v31.55,18.85 | v26.32,20.05 26.01,19.74 26.01,19.1 27.28,17.83 30.21,17.83 v30.53,18.15 30.53,16.25 29.58,15.29 29.58,11.48 30.53,10.53 32.44,10.53 32.75,10.85 32.75,12.34 v33.17,12.75
SCK  (via drill 0.35)
  Top 0.152: U2.17 26.94,10.8 v26.94,10.53 | R7.2 16.82,14.34 v16.88,14.34
  Bottom 0.152: TP2.TP 36.75,5.64 34.66,3.55 33.93,3.55 v26.94,10.53 18.15,10.53 17.2,11.48 17.2,14.02 v16.88,14.34
SCL  (via drill 0.35)
  Top 0.152: U2.28 27.6,20.27 28.22,20.89 28.31,20.89 | 28.31,20.89 30.96,20.89 32.75,19.1 v32.75,17.2 | v32.44,15.85 32.74,16.16 34.66,16.16 35.24,15.58 R14.2 | 28.31,20.89 28.39,20.98 v28.63,20.98 | U6.6 35.4,25.13 v35.18,25.34 35.18,28.31 36.67,29.8 36.82,29.95 IC1.10
  Bottom 0.152: v32.75,17.2 32.75,16.17 v32.44,15.85 | v28.63,20.98 30.24,22.6 32.75,22.6 35.18,25.02 v35.18,25.34
SDA  (via drill 0.35)
  Top 0.152: R13.2 v35.93,14.02 | U2.27 28.74,20.37 29.26,20.37 v29.26,20.29 | v31.77,11.43 31.77,14.69 31.17,15.29 v30.85,15.29 | IC1.9 36.75,29.45 35.61,28.31 35.61,26.09 35.92,25.78 U6.7 38.14,25.78 v39.11,24.82
  Bottom 0.152: v35.93,14.02 32.44,14.02 31.77,13.36 v31.77,11.43 | v39.11,24.82 38.15,25.77 36.56,25.77 33.07,22.28 31.17,22.28 29.26,20.37 v29.26,20.29 31.17,18.38 31.17,17.52 30.85,17.2 v30.85,15.29
VBATT  (via drill 0.35)
  Top 0.406: C3.2 27.78,36.78 27.2,37.36 | 27.2,37.36 27.04,37.52 J3.2 | U3.3 22.94,36.57 v23.87,36.57 26.41,36.57 27.2,37.36 | v8.94,36.88 v8.94,38.79 | v11.17,40.38 17.52,40.38 v17.83,40.06
  Bottom 0.406: S1.1 5.16,26.75 5.45,27.04 5.45,30.53 8.94,34.02 v8.94,36.88 | v8.94,38.79 10.53,40.38 v11.17,40.38 | v17.83,40.06 21.01,40.06 23.87,37.2 v23.87,36.57
VCHG
  Top 0.406: R4.1 19.32,37.15 C2.2 19,38.47 19,40.27 19.42,40.69 | U3.4 22.91,39.74 21.96,40.69 19.42,40.69 | 19.42,40.69 19.1,40.69 15.75,44.05 J4.2

### Text on the board
tPlace: 150R | #karpeDiem